# Altium schematic sheet v2.0.SchDoc
size 127 x 63 mm
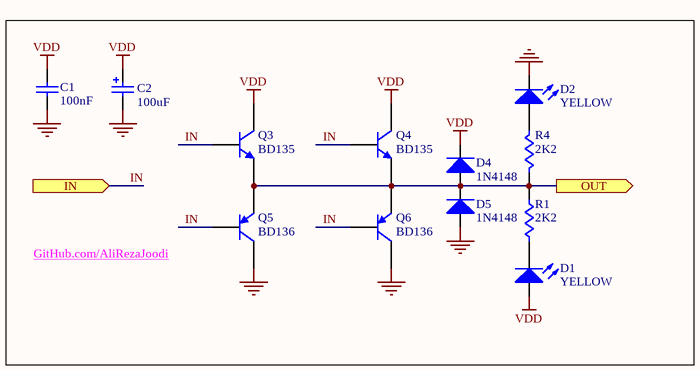
[diagram p0: v2.0.SchDoc]

## Parts
C1  100nF  [CAPNTO2.54-3.05x1.78A]
C2  100uF  [CAPPR2.5-6.3x5]
D1  YELLOW  [0805_Diode]
D2  YELLOW  [0805_Diode]
D4  1N4148  [DIODE0.4_Glass]
D5  1N4148  [DIODE0.4_Glass]
Q3  BD135  [SOT-32]
Q4  BD135  [SOT-32]
Q5  BD136  [SOT-32]
Q6  BD136  [SOT-32]
R1  2K2  [0805]
R4  2K2  [0805]

## Ports
IN (in), OUT (out)

## Nets
GND: C1.2 C2.2 D2.2(K) D5.1(A) Q5.C Q6.C
VDD: C1.1 C2.1 D1.1(A) D4.2(K) Q3.C Q4.C
IN: Q3.B Q4.B Q5.B Q6.B ; port IN
OUT: D4.1(A) D5.2(K) Q3.E Q4.E Q5.E Q6.E R1.1 R4.2 ; port OUT
NetD1_2: D1.2(K) R1.2
NetD2_1: D2.1(A) R4.1

## Notes on the sheet
- GitHub.com/AliRezaJoodi

## Library data of the parts
C1 = Cap: Capacitor; Manufacturer: Generic Components; Class I: Passive; Published: 8-Jun-2000; Revision: July-2002: Re-released for DXP Platform.; Publisher: Altium Limited; Class II: Capacitor
C2 = Cap Pol1: Polarized Capacitor (Radial); Manufacturer: Generic Components; Class I: Passive; Published: 8-Jun-2000; Revision: July-2002: Re-released for DXP Platform.; Publisher: Altium Limited; Class II: Capacitor
D1 D2 = Optical Transmitter: Typical INFRARED GaAs LED; Manufacturer: Generic Components; Class I: Optoelectronic; Published: 8-Jun-2000; Revision: July-2002: Re-released for DXP Platform.; Publisher: Altium Limited; Class II: LED
D4 D5 = Diode: Default Diode; Manufacturer: Generic Components; Class I: Discrete; Class II: Diode - Switching; Published: 8-Jun-2000; Revision: July-2002: Re-released for DXP Platform.; Publisher: Altium Limited
Q3 Q4 = BD139: NPN Transistor; E-mail: picpars@gmail.com; De: Seyed Mohsen Ghasemian; web: www.picpars.com
Q5 Q6 = BD138: PNP Transistor; E-mail: picpars@gmail.com; De: Seyed Mohsen Ghasemian; web: www.picpars.com
R1 R4 = Res1: Resistor; Manufacturer: Generic Components; Class I: Passive; Published: 8-Jun-2000; Revision: July-2002: Re-released for DXP Platform.; Publisher: Altium Limited; Class II: Resistor